# Altium schematic sheet Sheet1.SchDoc
size A4
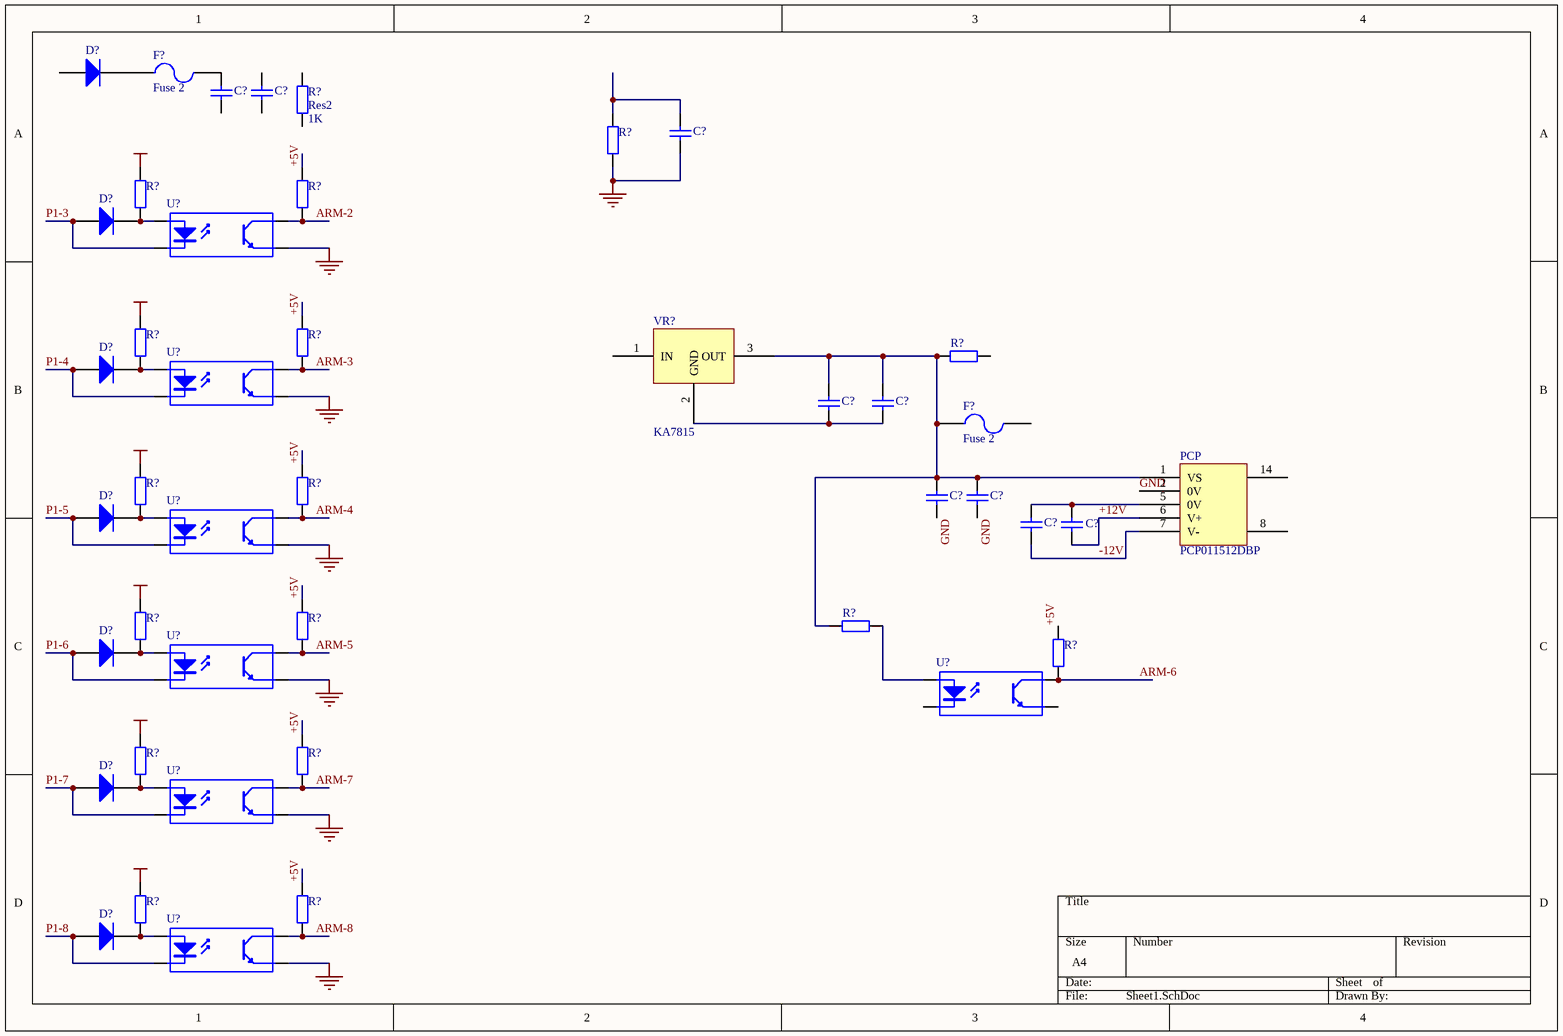
[diagram p0: Sheet1.SchDoc]

## Parts
(Parts that share a designator on the sheet are numbered #1, #2 ... from top to bottom, then left to right.)
C?#1  Cap  [RAD-0.3]  (value not drawn)
C?#2  Cap  [RAD-0.3]  (value not drawn)
C?#3  Cap  [RAD-0.3]  (value not drawn)
C?#4  Cap  [RAD-0.3]  (value not drawn)
C?#5  Cap  [RAD-0.3]  (value not drawn)
C?#6  Cap  [RAD-0.3]  (value not drawn)
C?#7  Cap  [RAD-0.3]  (value not drawn)
C?#8  Cap  [RAD-0.3]  (value not drawn)
C?#9  Cap  [RAD-0.3]  (value not drawn)
D?#1  Diode 1N4007  [DO-41]  (value not drawn)
D?#2  Diode 1N4007  [DO-41]  (value not drawn)
D?#3  Diode 1N4007  [DO-41]  (value not drawn)
D?#4  Diode 1N4007  [DO-41]  (value not drawn)
D?#5  Diode 1N4007  [DO-41]  (value not drawn)
D?#6  Diode 1N4007  [DO-41]  (value not drawn)
D?#7  Diode 1N4007  [DO-41]  (value not drawn)
F?#1  Fuse 2  [PIN-W2/E2.8]
F?#2  Fuse 2  [PIN-W2/E2.8]
PCP  PCP011512DBP
R?#1  Res2  value 1K  [AXIAL-0.4]
R?#2  Res2  [AXIAL-0.4]  (value not drawn)
R?#3  Res2  [AXIAL-0.4]  (value not drawn)
R?#4  Res2  [AXIAL-0.4]  (value not drawn)
R?#5  Res2  [AXIAL-0.4]  (value not drawn)
R?#6  Res2  [AXIAL-0.4]  (value not drawn)
R?#7  Res2  [AXIAL-0.4]  (value not drawn)
R?#8  Res2  [AXIAL-0.4]  (value not drawn)
R?#9  Res2  [AXIAL-0.4]  (value not drawn)
R?#10  Res2  [AXIAL-0.4]  (value not drawn)
R?#11  Res2  [AXIAL-0.4]  (value not drawn)
R?#12  Res2  [AXIAL-0.4]  (value not drawn)
R?#13  Res2  [AXIAL-0.4]  (value not drawn)
R?#14  Res2  [AXIAL-0.4]  (value not drawn)
R?#15  Res2  [AXIAL-0.4]  (value not drawn)
R?#16  Res2  [AXIAL-0.4]  (value not drawn)
R?#17  Res2  [AXIAL-0.4]  (value not drawn)
U?#1  Optoisolator1  [DIP-4]  (value not drawn)
U?#2  Optoisolator1  [DIP-4]  (value not drawn)
U?#3  Optoisolator1  [DIP-4]  (value not drawn)
U?#4  Optoisolator1  [DIP-4]  (value not drawn)
U?#5  Optoisolator1  [DIP-4]  (value not drawn)
U?#6  Optoisolator1  [DIP-4]  (value not drawn)
U?#7  Optoisolator1  [DIP-4]  (value not drawn)
VR?  KA7815

## Nets
GND: C?#3.1 C?#6.1 C?#7.1 PCP.2(0V) R?#2.1 U?#1.3(E) U?#2.3(E) U?#3.3(E) U?#4.3(E) U?#6.3(E) U?#7.3(E)
VCC: R?#3.2 R?#5.2 R?#8.2 R?#10.2 R?#14.2 R?#16.2
+5V: R?#4.2 R?#6.2 R?#9.2 R?#11.2 R?#13.1 R?#15.2 R?#17.2
+12V: C?#9.1 PCP.6(V+)
-12V: C?#8.1 PCP.7(V-)
ARM-2: R?#4.1 U?#1.4(C)
ARM-3: R?#6.1 U?#2.4(C)
ARM-4: R?#9.1 U?#3.4(C)
ARM-5: R?#11.1 U?#4.4(C)
ARM-6: R?#13.2 U?#5.4(C)
ARM-7: R?#15.1 U?#6.4(C)
ARM-8: R?#17.1 U?#7.4(C)
P1-3: D?#2.1(A) U?#1.2(K)
P1-4: D?#3.1(A) U?#2.2(K)
P1-5: D?#4.1(A) U?#3.2(K)
P1-6: D?#5.1(A) U?#4.2(K)
P1-7: D?#6.1(A) U?#6.2(K)
P1-8: D?#7.1(A) U?#7.2(K)
NetC?#1_2: C?#1.2 F?#1.2
NetC?#3_2: C?#3.2 R?#2.2
NetC?#4_1: C?#4.1 C?#5.1 VR?.2(GND)
NetC?#4_2: C?#4.2 C?#5.2 C?#6.2 C?#7.2 F?#2.1 PCP.1(VS) R?#7.2 R?#12.2 VR?.3(OUT)
NetC?#8_2: C?#8.2 C?#9.2 PCP.5(0V)
NetD?#1_2: D?#1.2(K) F?#1.1
NetD?#2_2: D?#2.2(K) R?#3.1 U?#1.1(A)
NetD?#3_2: D?#3.2(K) R?#5.1 U?#2.1(A)
NetD?#4_2: D?#4.2(K) R?#8.1 U?#3.1(A)
NetD?#5_2: D?#5.2(K) R?#10.1 U?#4.1(A)
NetD?#6_2: D?#6.2(K) R?#14.1 U?#6.1(A)
NetD?#7_2: D?#7.2(K) R?#16.1 U?#7.1(A)
NetR?#12_1: R?#12.1 U?#5.1(A)

Not connected (* = marked no-connect by the designer): C?#1 1; C?#2 1 2; D?#1 1(A); F?#2 2; PCP 8(6) 14; R?#1 1 2; R?#7 1; U?#5 2(K) 3(E); VR? 1(IN)

## Library data of the parts
C?#1-C?#3 C?#6-C?#9 = Cap: Capacitor; Value: 0.01uF; Published: 8-Jun-2000; LatestRevisionDate: 17-Jul-2002; LatestRevisionNote: Re-released for DXP Platform.; PackageReference: RAD-0.3; Publisher: Altium Limited
C?#4 C?#5 = Cap: Capacitor; Value: 100pF; Published: 8-Jun-2000; LatestRevisionDate: 17-Jul-2002; LatestRevisionNote: Re-released for DXP Platform.; PackageReference: RAD-0.3; Publisher: Altium Limited
D?#1-D?#7 = Diode 1N4007: 1 Amp General Purpose Rectifier; Published: 8-Jun-2000; LatestRevisionDate: 17-Jul-2002; LatestRevisionNote: Re-released for DXP Platform.; DatasheetDocument: 1998; PackageDocument: Aug-1999; PackageReference: DO-41; Publisher: Altium Limited; Code_JEDEC: DO-204-AL; ComponentLink1Description: Manufacturer Link; ComponentLink1URL: http://www.fairchildsemi.com/; ComponentLink2Description: Datasheet; ComponentLink2URL: http://www.fairchildsemi.com/ds/1N%2F1N4001.pdf
F?#1 F?#2 = Fuse 2: Fuse; Published: 8-Jun-2000; LatestRevisionDate: 17-Jul-2002; LatestRevisionNote: Re-released for DXP Platform.; PackageReference: PIN-W2/E2.8; Publisher: Altium Limited
PCP VR? = Component_1
R?#1 = Res2: Resistor; Published: 8-Jun-2000; LatestRevisionDate: 17-Jul-2002; LatestRevisionNote: Re-released for DXP Platform.; PackageReference: AXIAL-0.4; Publisher: Altium Limited
R?#2-R?#17 = Res2: Resistor; Value: 1K; Published: 8-Jun-2000; LatestRevisionDate: 17-Jul-2002; LatestRevisionNote: Re-released for DXP Platform.; PackageReference: AXIAL-0.4; Publisher: Altium Limited
U?#1-U?#7 = Optoisolator1: 4-Pin Phototransistor Optocoupler; Published: 24-Mar-1999; LatestRevisionDate: 04-Mar-2005; LatestRevisionNote: Sch pins 3 & 4 Swapped.; DatasheetDocument: Nov-2003; PackageReference: DIP-4; Publisher: Altium Limited